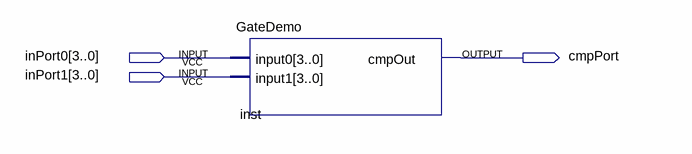
[diagram p0: schematic sheet]
// Quartus schematic EqCmpDemo.bdf as structural Verilog: 1 symbols, 3 pins
module EqCmpDemo (
  input  [3:0] inPort0,
  input  [3:0] inPort1,
  output cmpPort
);

  GateDemo inst (.input0(inPort0), .input1(inPort1), .cmpOut(cmpPort));
endmodule
